# EAGLE schematic EL1034v4 (EAGLE 7.7.0)
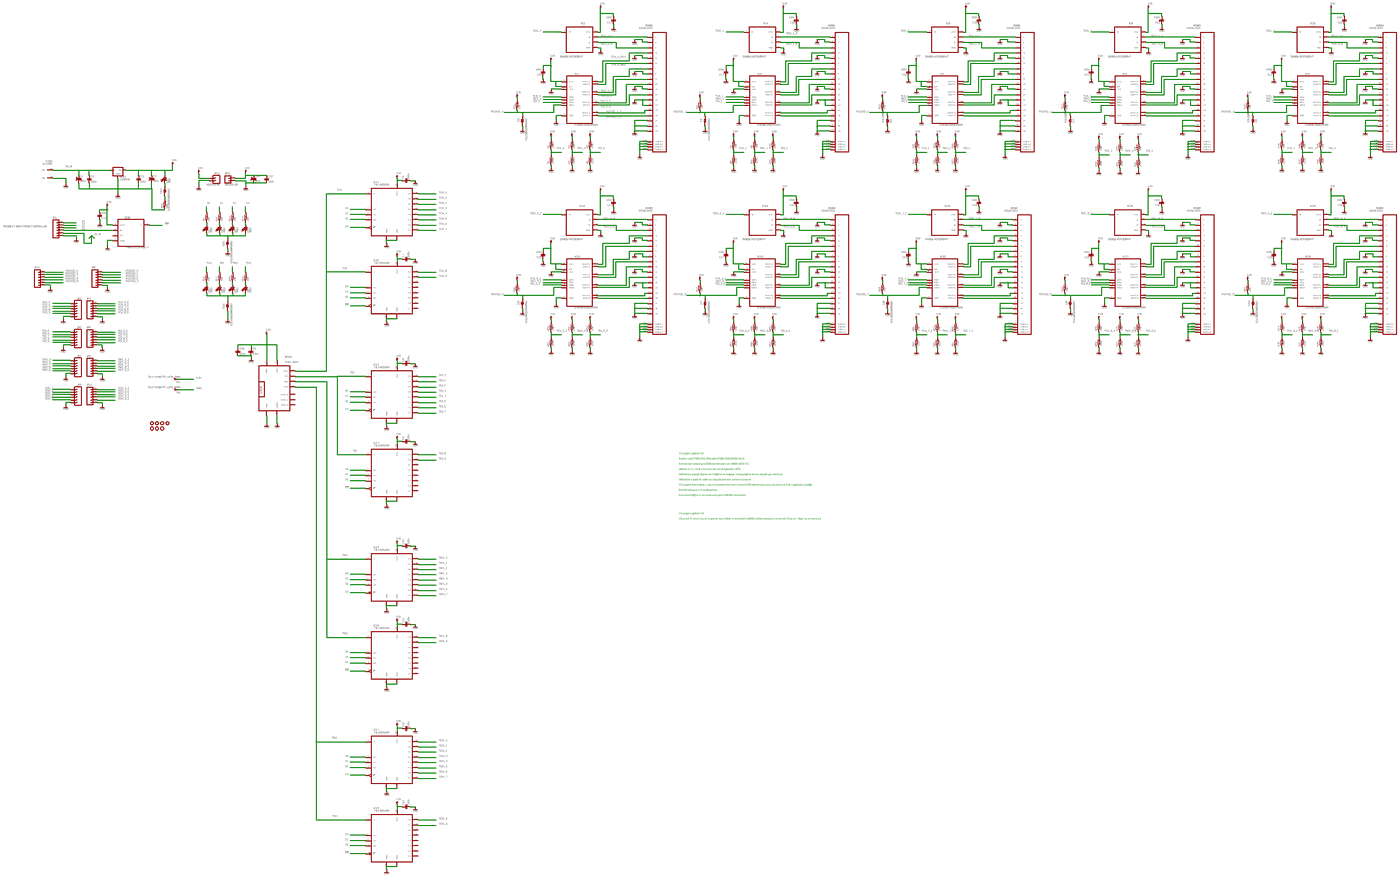
[diagram p0: schematic, sheet 1, overview]
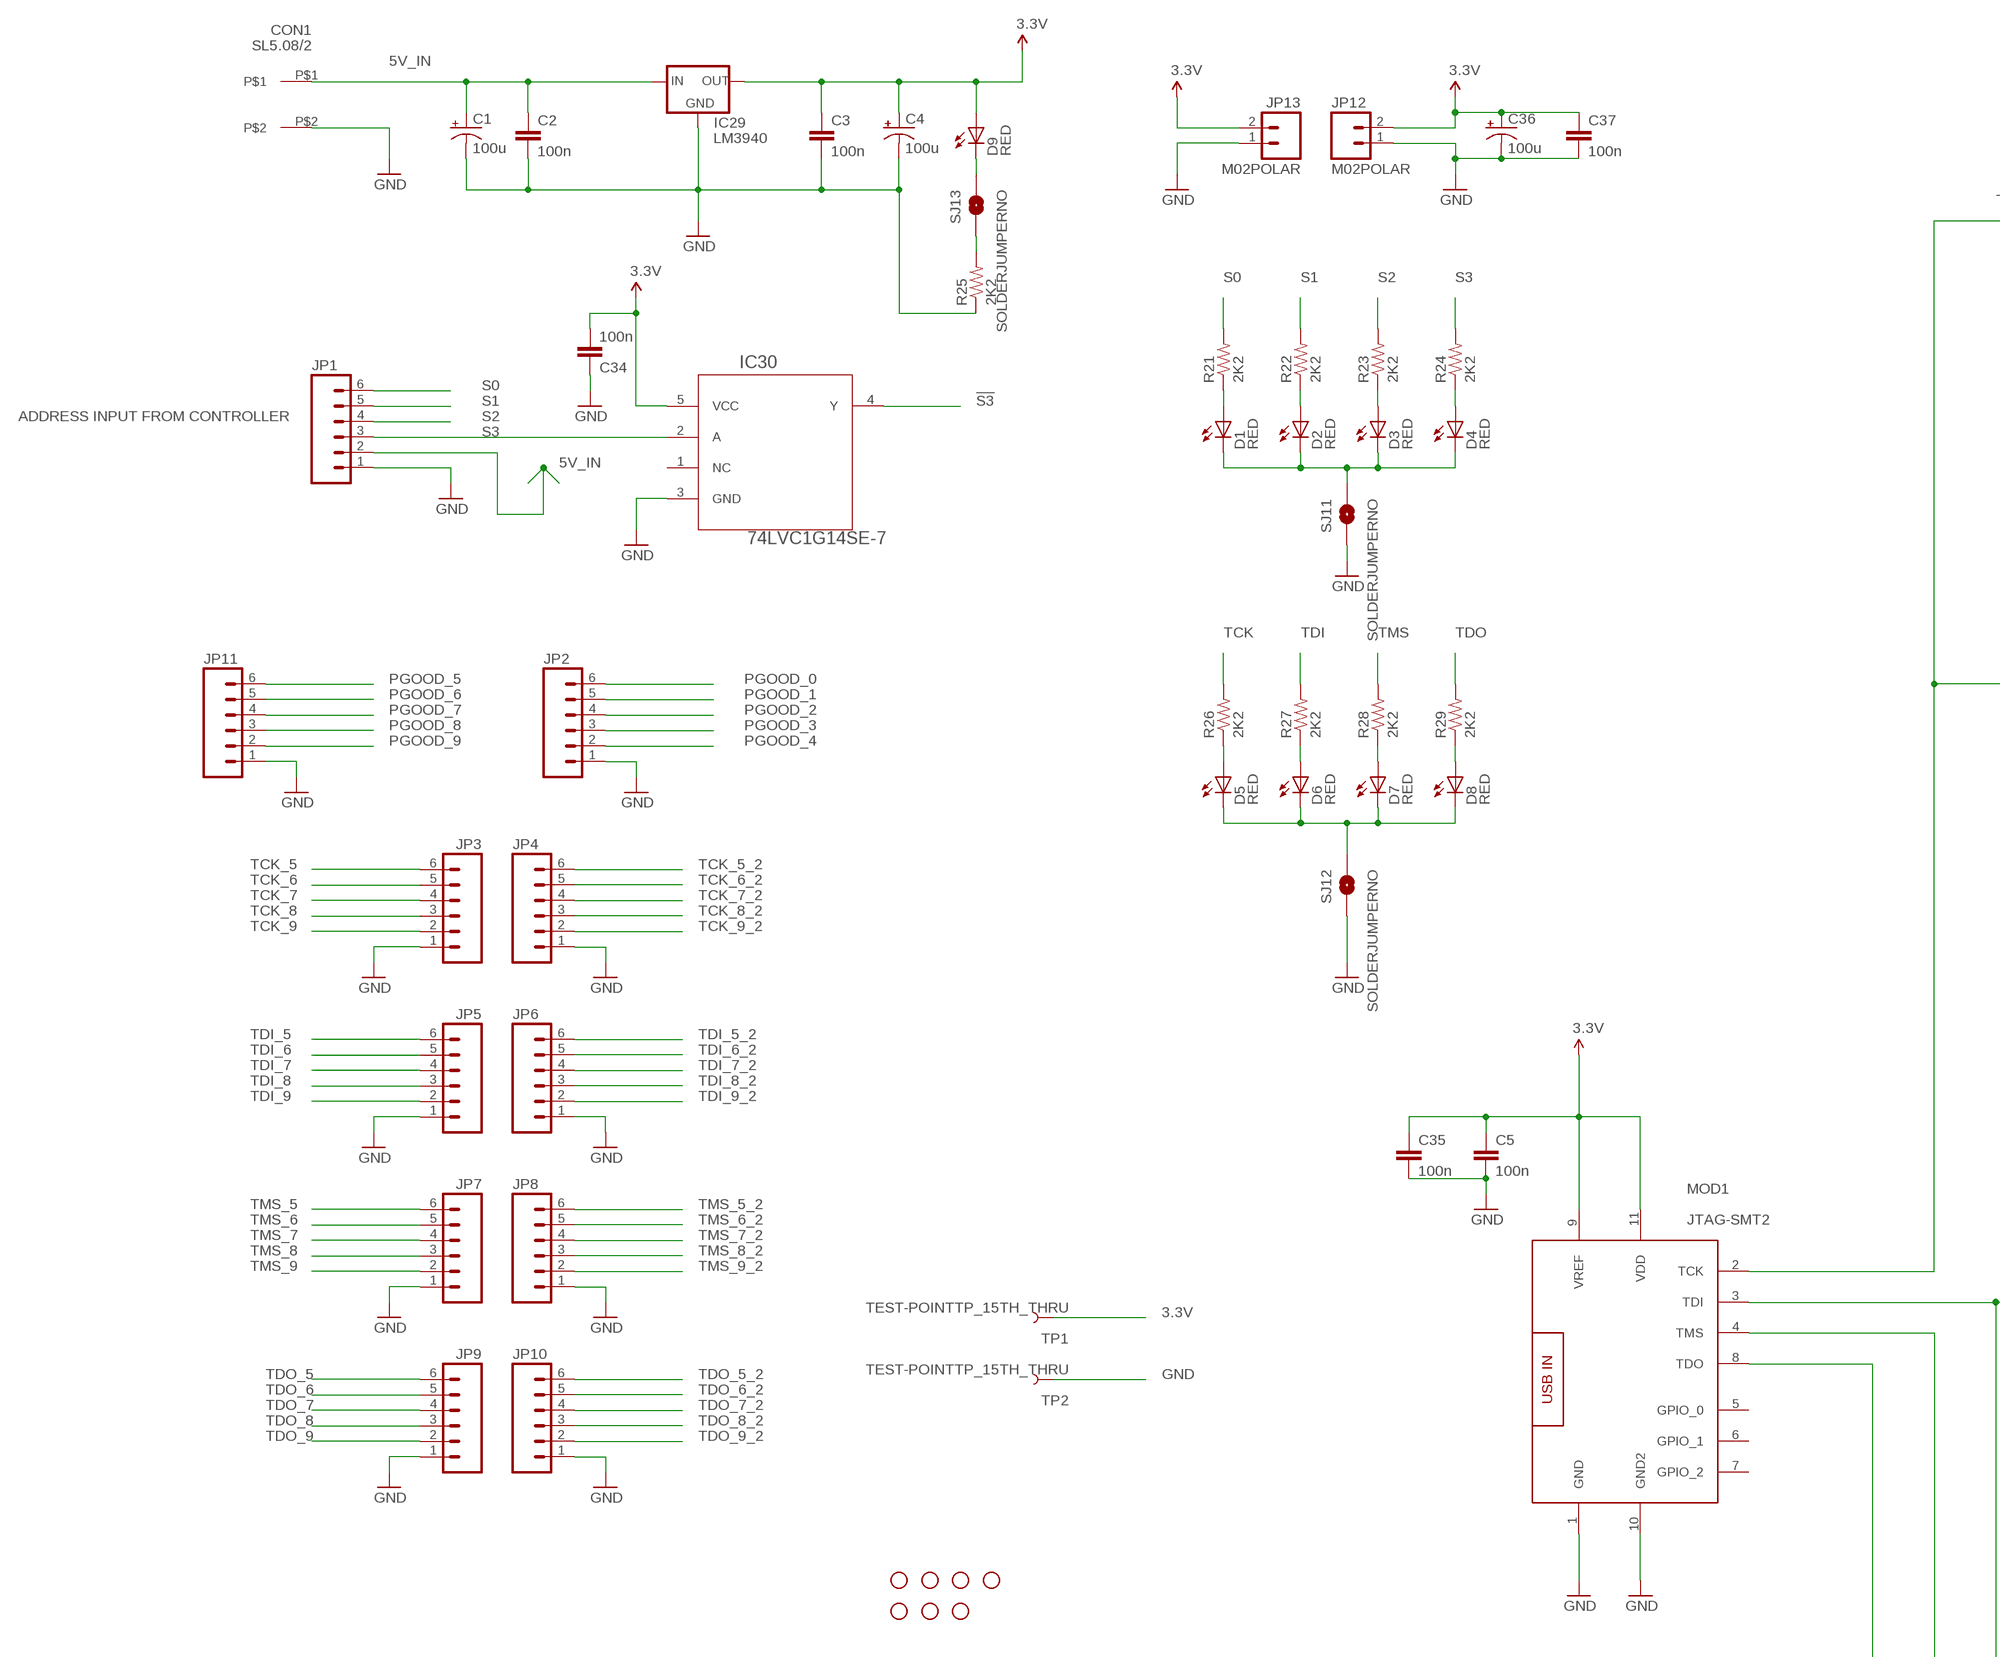
[diagram p1: schematic, sheet 1, part 1 of 6]
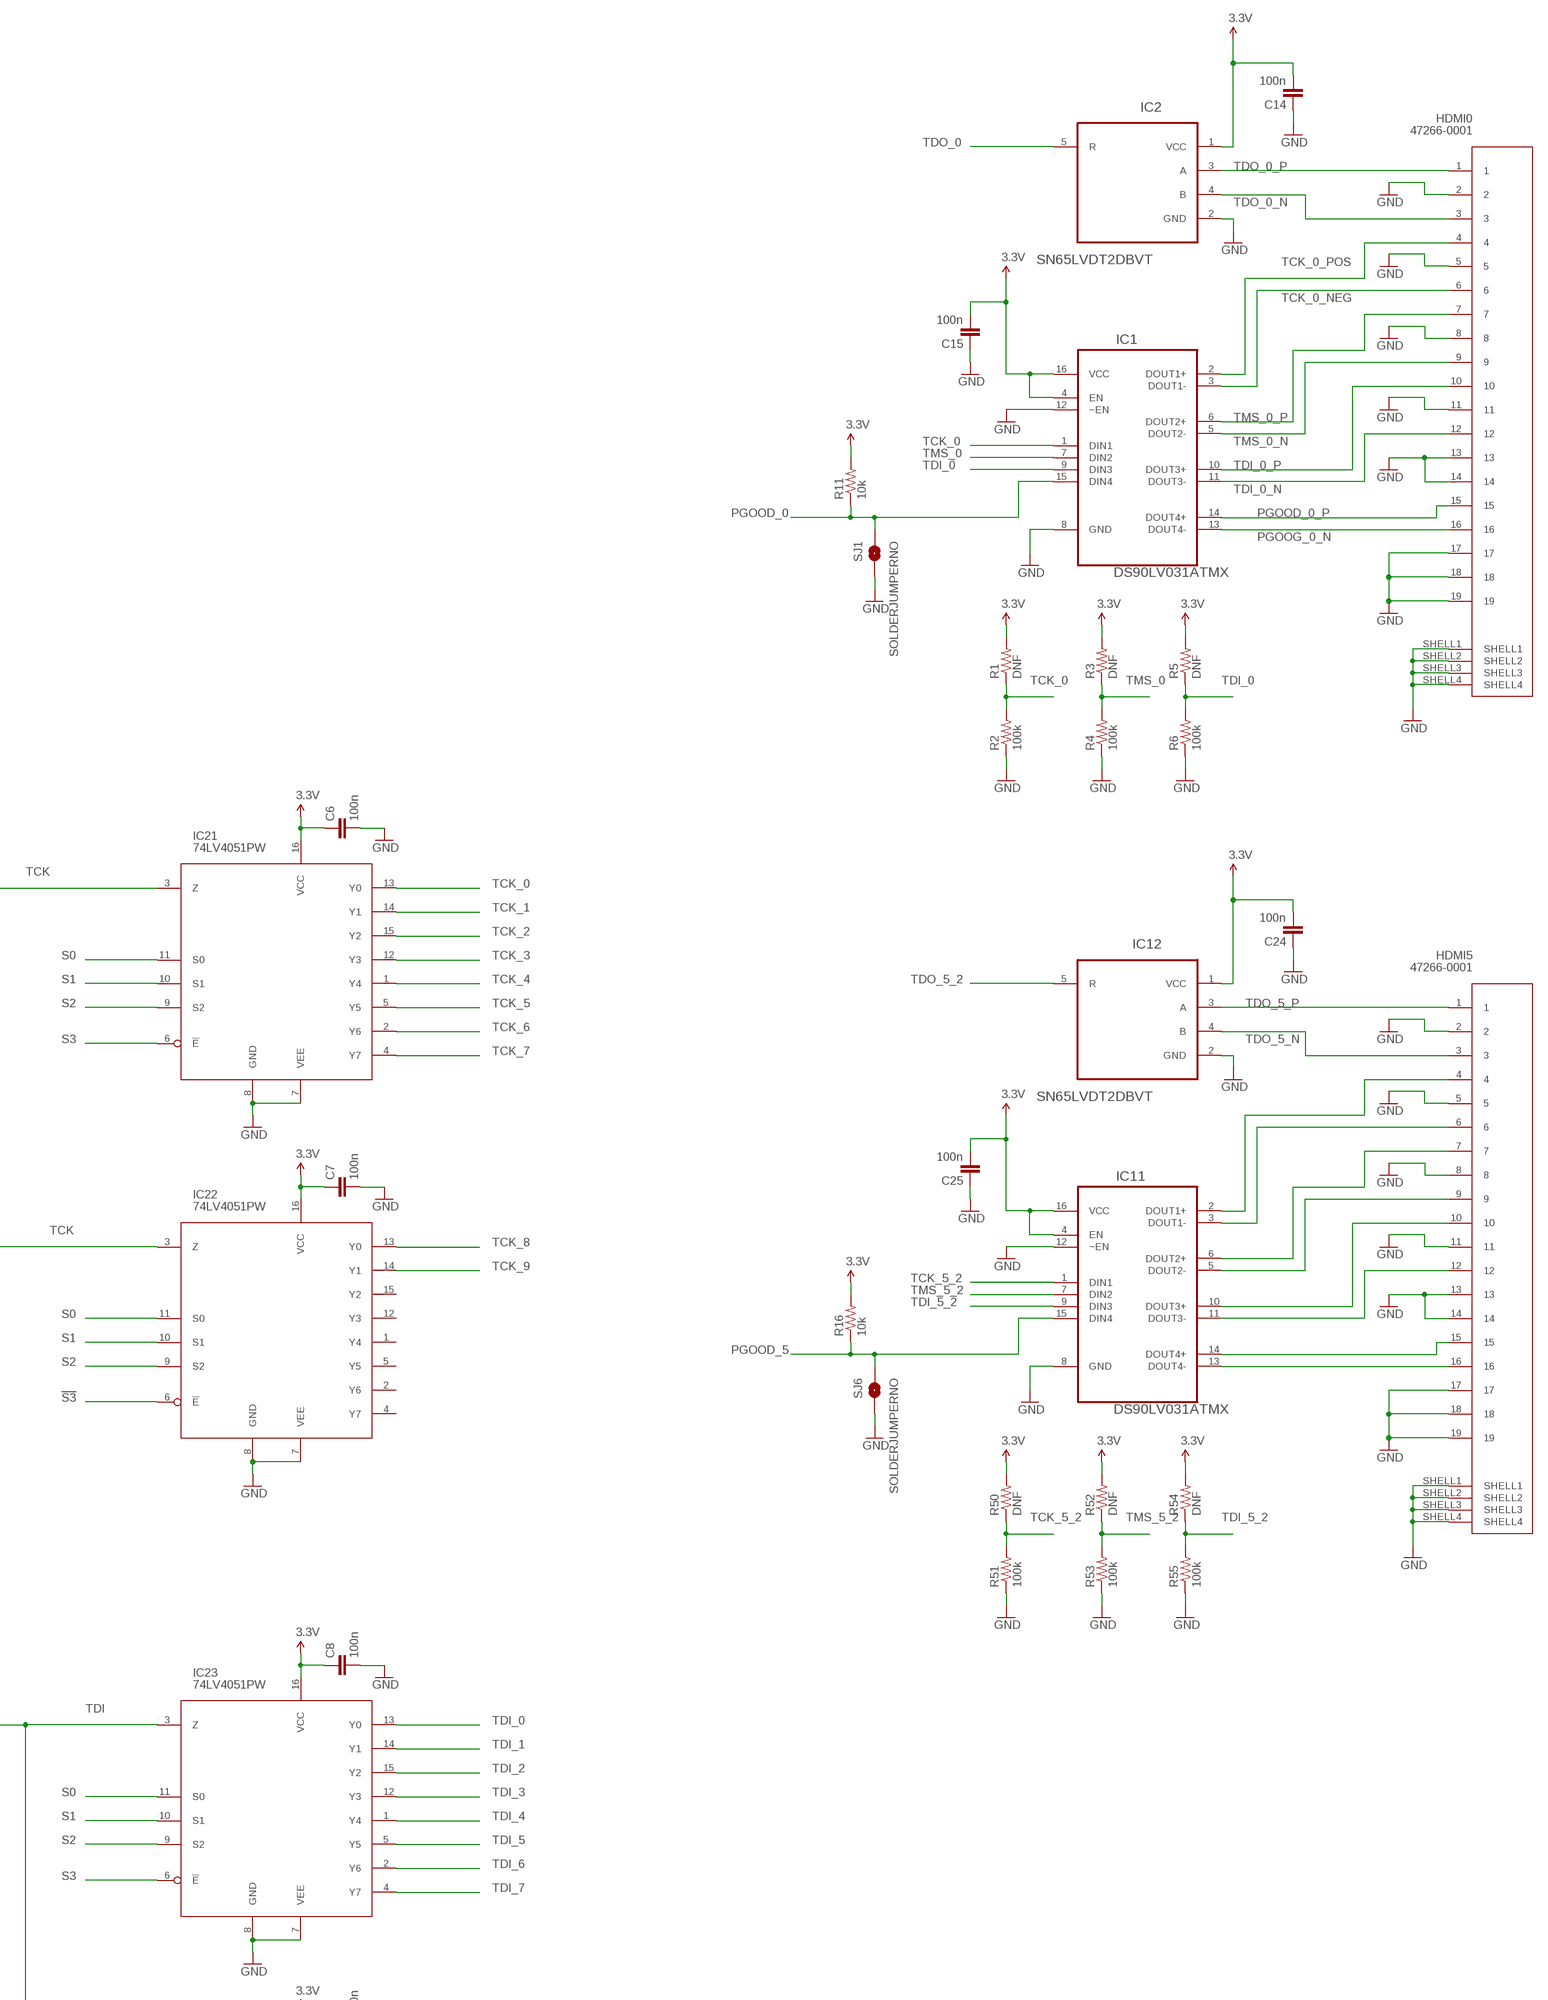
[diagram p2: schematic, sheet 1, part 2 of 6]
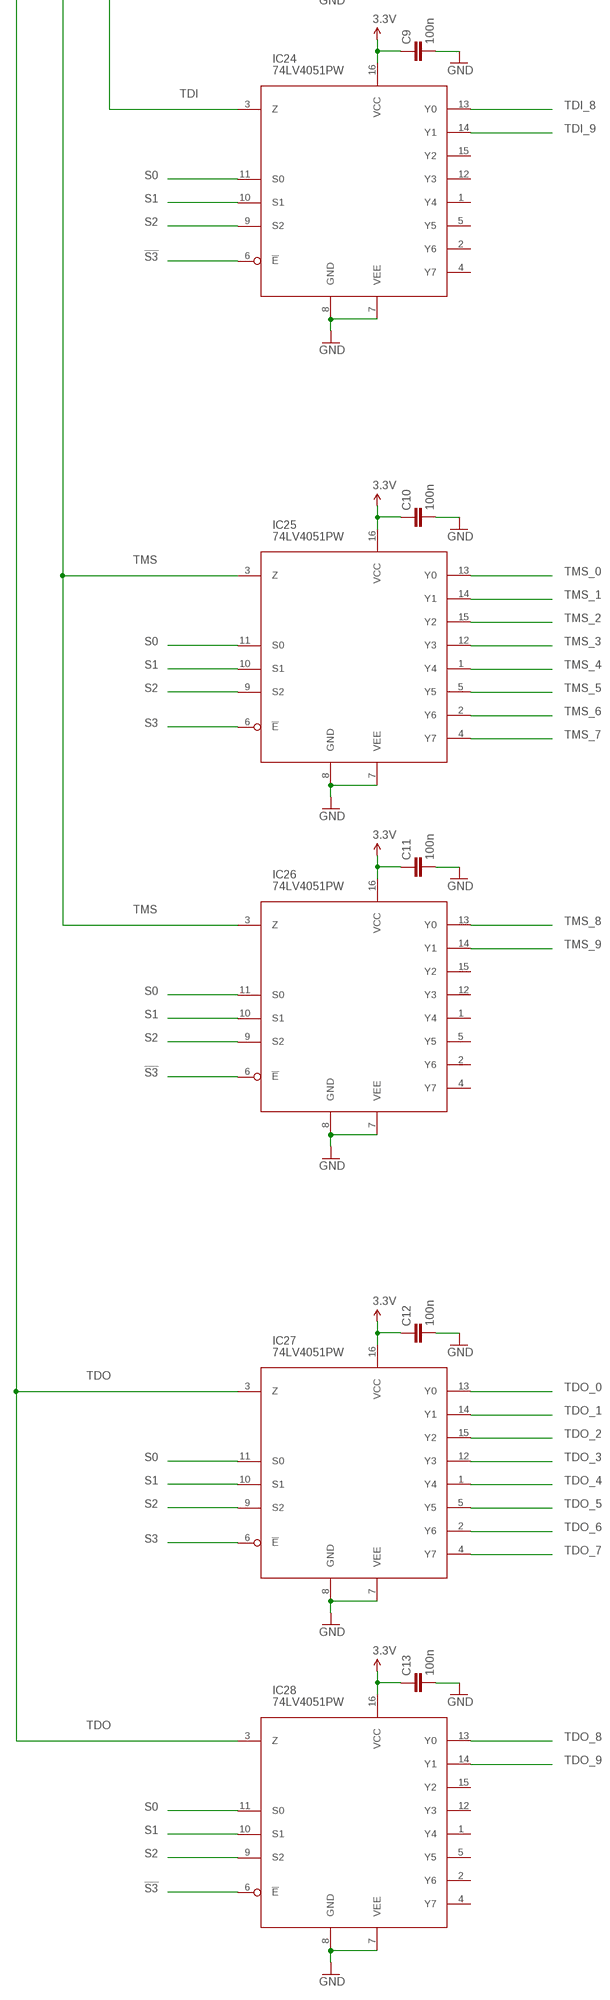
[diagram p3: schematic, sheet 1, part 3 of 6]
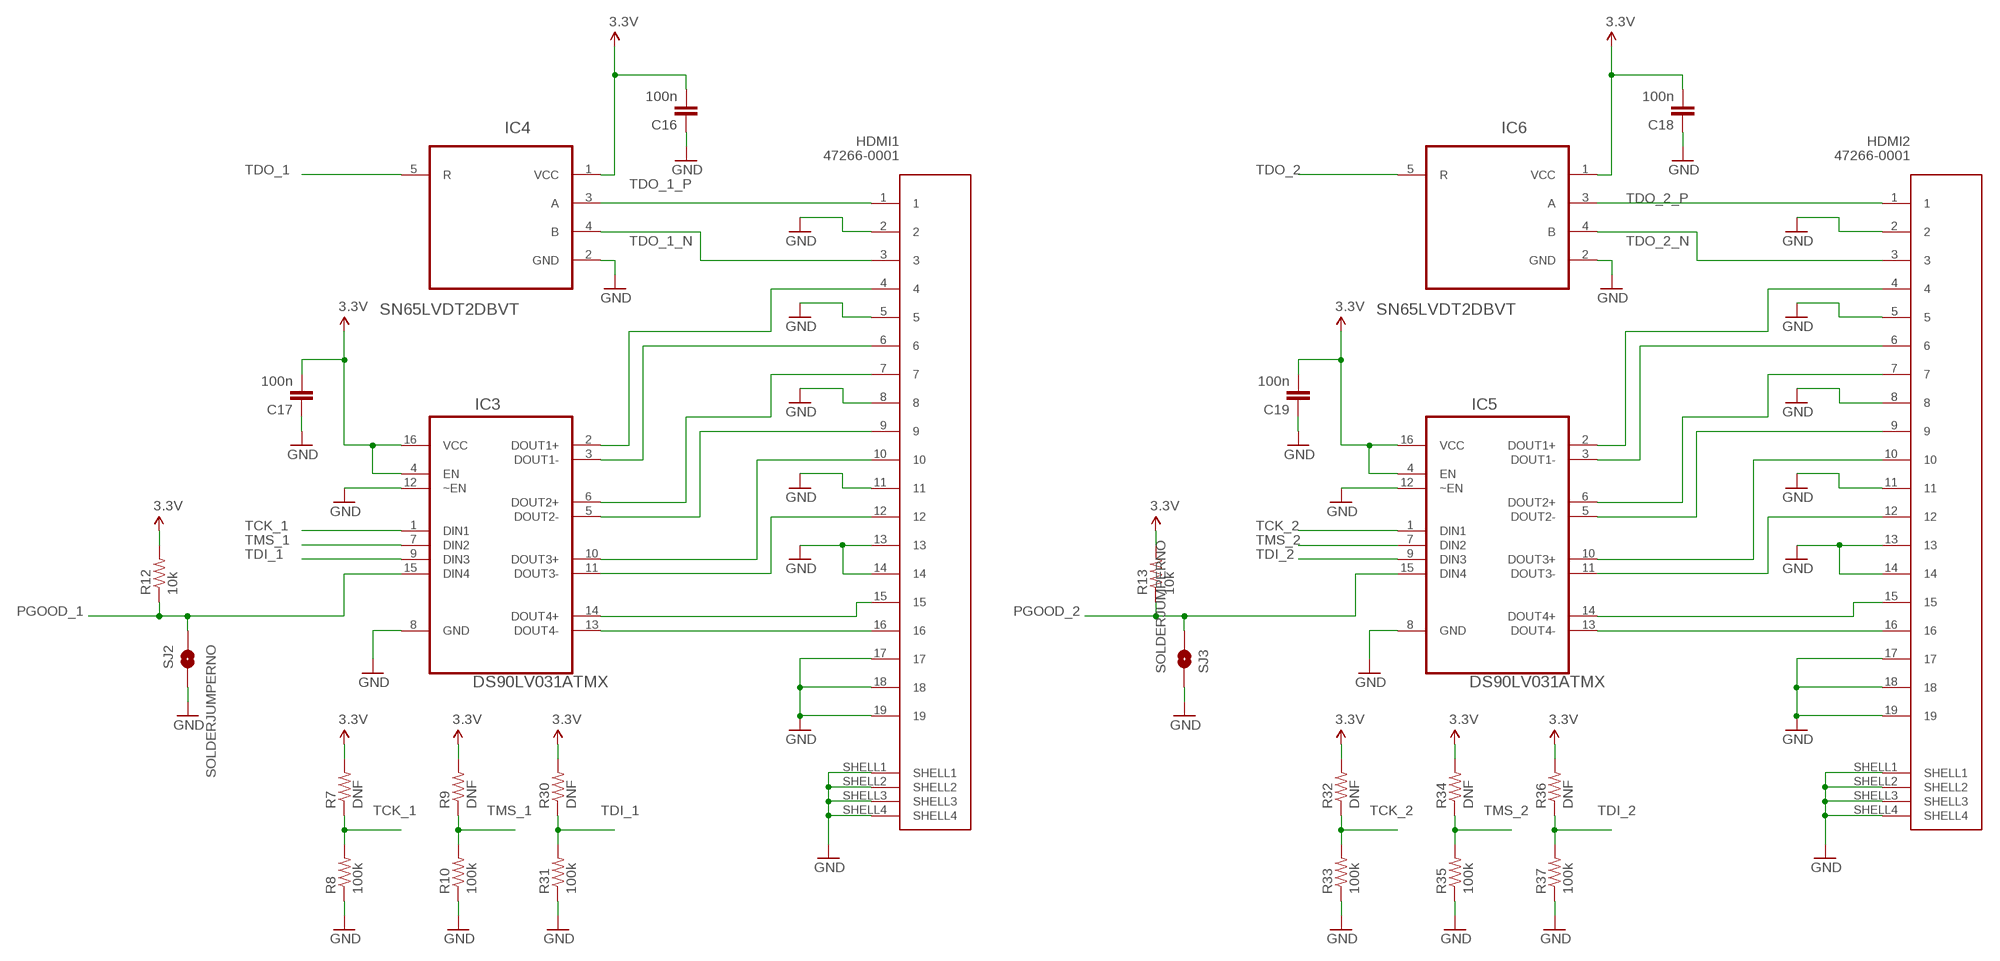
[diagram p4: schematic, sheet 1, part 4 of 6]
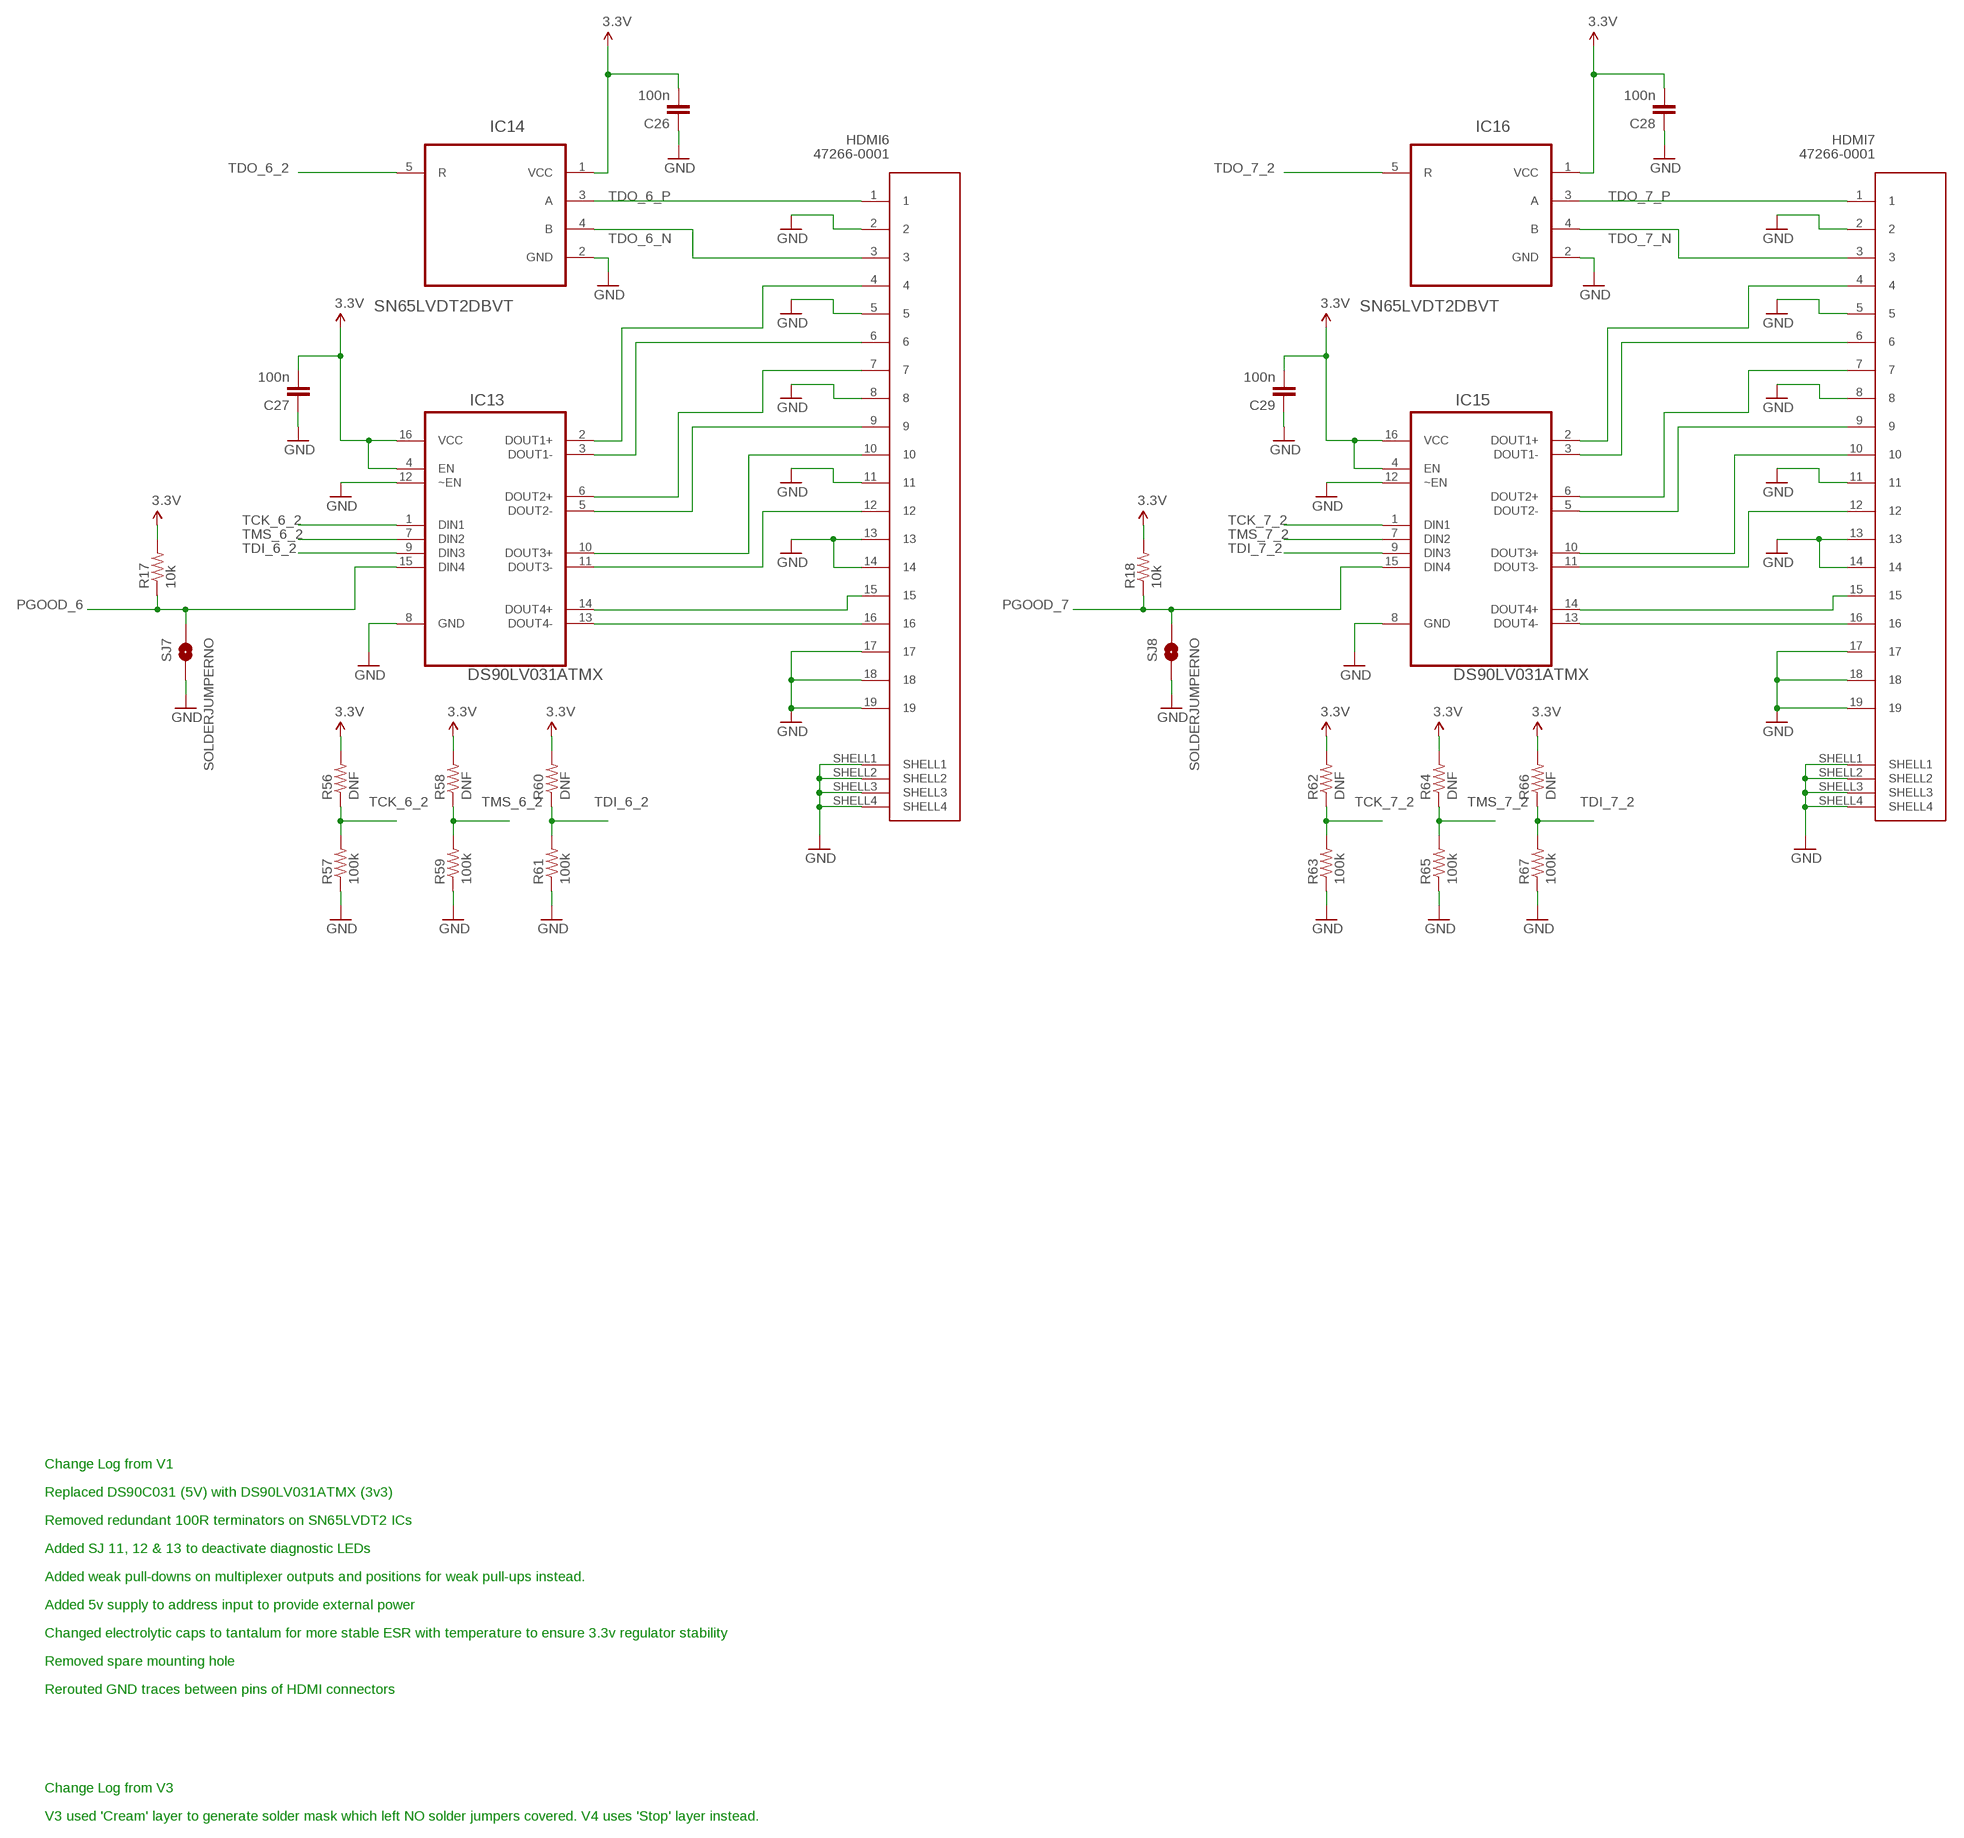
[diagram p5: schematic, sheet 1, part 5 of 6]
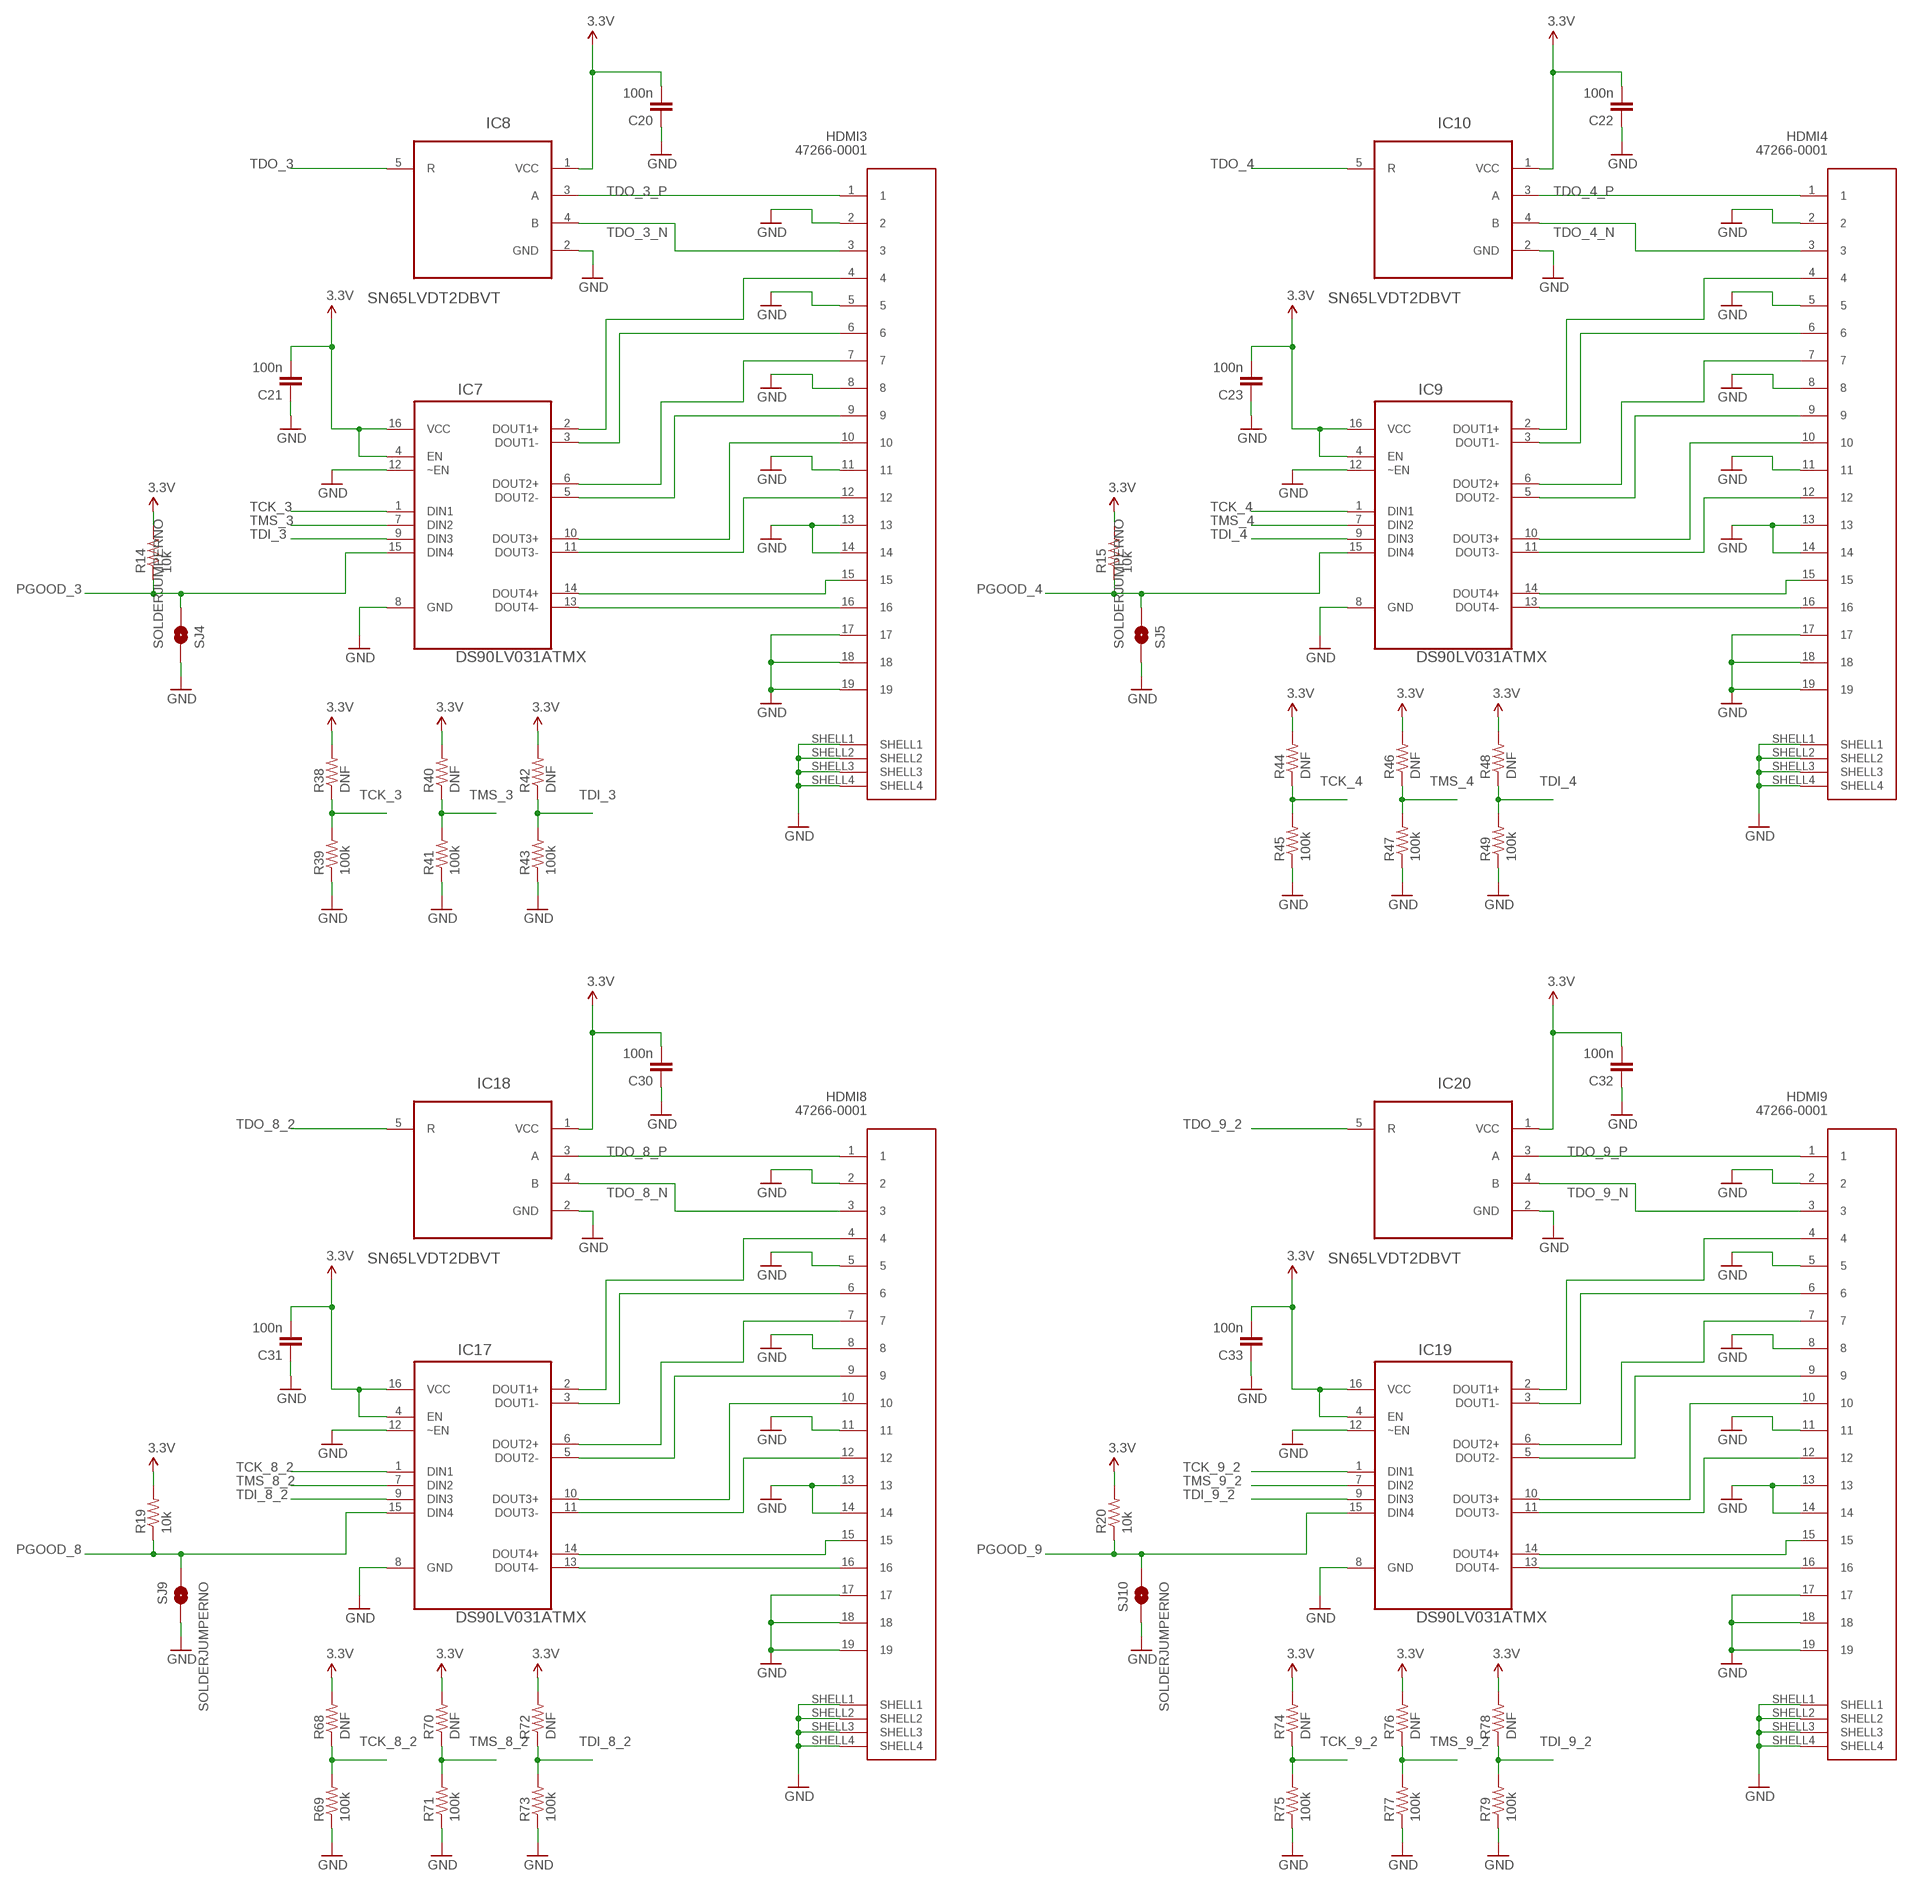
[diagram p6: schematic, sheet 1, part 6 of 6]

## Parts
C1  100u  CAP_POL7343  [EIA7343]
C2  100n  CAP0805  [0805]
C3  100n  CAP0805  [0805]
C4  100u  CAP_POL7343  [EIA7343]
C5  100n  CAP0805  [0805]
C6  100n  CAP0805  [0805]
C7  100n  CAP0805  [0805]
C8  100n  CAP0805  [0805]
C9  100n  CAP0805  [0805]
C10  100n  CAP0805  [0805]
C11  100n  CAP0805  [0805]
C12  100n  CAP0805  [0805]
C13  100n  CAP0805  [0805]
C14  100n  CAP0805  [0805]
C15  100n  CAP0805  [0805]
C16  100n  CAP0805  [0805]
C17  100n  CAP0805  [0805]
C18  100n  CAP0805  [0805]
C19  100n  CAP0805  [0805]
C20  100n  CAP0805  [0805]
C21  100n  CAP0805  [0805]
C22  100n  CAP0805  [0805]
C23  100n  CAP0805  [0805]
C24  100n  CAP0805  [0805]
C25  100n  CAP0805  [0805]
C26  100n  CAP0805  [0805]
C27  100n  CAP0805  [0805]
C28  100n  CAP0805  [0805]
C29  100n  CAP0805  [0805]
C30  100n  CAP0805  [0805]
C31  100n  CAP0805  [0805]
C32  100n  CAP0805  [0805]
C33  100n  CAP0805  [0805]
C34  100n  CAP0805  [0805]
C35  100n  CAP0805  [0805]
C36  100u  CAP_POL7343  [EIA7343]
C37  100n  CAP0805  [0805]
CON1  SL5.08/2  [SL5.08/2]
D1  RED  LED-RED0603  [LED-0603]
D2  RED  LED-RED0603  [LED-0603]
D3  RED  LED-RED0603  [LED-0603]
D4  RED  LED-RED0603  [LED-0603]
D5  RED  LED-RED0603  [LED-0603]
D6  RED  LED-RED0603  [LED-0603]
D7  RED  LED-RED0603  [LED-0603]
D8  RED  LED-RED0603  [LED-0603]
D9  RED  LED-RED0603  [LED-0603]
HDMI0  47266-0001  [47266-0001]
HDMI1  47266-0001  [47266-0001]
HDMI2  47266-0001  [47266-0001]
HDMI3  47266-0001  [47266-0001]
HDMI4  47266-0001  [47266-0001]
HDMI5  47266-0001  [47266-0001]
HDMI6  47266-0001  [47266-0001]
HDMI7  47266-0001  [47266-0001]
HDMI8  47266-0001  [47266-0001]
HDMI9  47266-0001  [47266-0001]
IC1  DS90LV031ATMX  DS90C031TM  [SOIC127P600X175-16N]
IC2  SN65LVDT2DBVT  [SOT95P280X145-5N]
IC3  DS90LV031ATMX  DS90C031TM  [SOIC127P600X175-16N]
IC4  SN65LVDT2DBVT  [SOT95P280X145-5N]
IC5  DS90LV031ATMX  DS90C031TM  [SOIC127P600X175-16N]
IC6  SN65LVDT2DBVT  [SOT95P280X145-5N]
IC7  DS90LV031ATMX  DS90C031TM  [SOIC127P600X175-16N]
IC8  SN65LVDT2DBVT  [SOT95P280X145-5N]
IC9  DS90LV031ATMX  DS90C031TM  [SOIC127P600X175-16N]
IC10  SN65LVDT2DBVT  [SOT95P280X145-5N]
IC11  DS90LV031ATMX  DS90C031TM  [SOIC127P600X175-16N]
IC12  SN65LVDT2DBVT  [SOT95P280X145-5N]
IC13  DS90LV031ATMX  DS90C031TM  [SOIC127P600X175-16N]
IC14  SN65LVDT2DBVT  [SOT95P280X145-5N]
IC15  DS90LV031ATMX  DS90C031TM  [SOIC127P600X175-16N]
IC16  SN65LVDT2DBVT  [SOT95P280X145-5N]
IC17  DS90LV031ATMX  DS90C031TM  [SOIC127P600X175-16N]
IC18  SN65LVDT2DBVT  [SOT95P280X145-5N]
IC19  DS90LV031ATMX  DS90C031TM  [SOIC127P600X175-16N]
IC20  SN65LVDT2DBVT  [SOT95P280X145-5N]
IC21  74LV4051PW  [TSSOP16]
IC22  74LV4051PW  [TSSOP16]
IC23  74LV4051PW  [TSSOP16]
IC24  74LV4051PW  [TSSOP16]
IC25  74LV4051PW  [TSSOP16]
IC26  74LV4051PW  [TSSOP16]
IC27  74LV4051PW  [TSSOP16]
IC28  74LV4051PW  [TSSOP16]
IC29  LM3940  V_REG_78XXSINK  [TO220-IGO]
IC30  74LVC1G14SE-7  [SOT65P210X110-5N]
JP1  M06POLAR  [MOLEX-1X6]
JP2  M06POLAR  [MOLEX-1X6]
JP3  M06POLAR  [MOLEX-1X6]
JP4  M06POLAR  [MOLEX-1X6]
JP5  M06POLAR  [MOLEX-1X6]
JP6  M06POLAR  [MOLEX-1X6]
JP7  M06POLAR  [MOLEX-1X6]
JP8  M06POLAR  [MOLEX-1X6]
JP9  M06POLAR  [MOLEX-1X6]
JP10  M06POLAR  [MOLEX-1X6]
JP11  M06POLAR  [MOLEX-1X6]
JP12  M02POLAR  [MOLEX-1X2]
JP13  M02POLAR  [MOLEX-1X2]
MOD1  JTAG-SMT2  [JTAG_SMT2]
R1  DNF  RESISTOR0603-RES  [0603-RES]
R2  100k  RESISTOR0603-RES  [0603-RES]
R3  DNF  RESISTOR0603-RES  [0603-RES]
R4  100k  RESISTOR0603-RES  [0603-RES]
R5  DNF  RESISTOR0603-RES  [0603-RES]
R6  100k  RESISTOR0603-RES  [0603-RES]
R7  DNF  RESISTOR0603-RES  [0603-RES]
R8  100k  RESISTOR0603-RES  [0603-RES]
R9  DNF  RESISTOR0603-RES  [0603-RES]
R10  100k  RESISTOR0603-RES  [0603-RES]
R11  10k  RESISTOR0603-RES  [0603-RES]
R12  10k  RESISTOR0603-RES  [0603-RES]
R13  10k  RESISTOR0603-RES  [0603-RES]
R14  10k  RESISTOR0603-RES  [0603-RES]
R15  10k  RESISTOR0603-RES  [0603-RES]
R16  10k  RESISTOR0603-RES  [0603-RES]
R17  10k  RESISTOR0603-RES  [0603-RES]
R18  10k  RESISTOR0603-RES  [0603-RES]
R19  10k  RESISTOR0603-RES  [0603-RES]
R20  10k  RESISTOR0603-RES  [0603-RES]
R21  2K2  RESISTOR0603-RES  [0603-RES]
R22  2K2  RESISTOR0603-RES  [0603-RES]
R23  2K2  RESISTOR0603-RES  [0603-RES]
R24  2K2  RESISTOR0603-RES  [0603-RES]
R25  2K2  RESISTOR0603-RES  [0603-RES]
R26  2K2  RESISTOR0603-RES  [0603-RES]
R27  2K2  RESISTOR0603-RES  [0603-RES]
R28  2K2  RESISTOR0603-RES  [0603-RES]
R29  2K2  RESISTOR0603-RES  [0603-RES]
R30  DNF  RESISTOR0603-RES  [0603-RES]
R31  100k  RESISTOR0603-RES  [0603-RES]
R32  DNF  RESISTOR0603-RES  [0603-RES]
R33  100k  RESISTOR0603-RES  [0603-RES]
R34  DNF  RESISTOR0603-RES  [0603-RES]
R35  100k  RESISTOR0603-RES  [0603-RES]
R36  DNF  RESISTOR0603-RES  [0603-RES]
R37  100k  RESISTOR0603-RES  [0603-RES]
R38  DNF  RESISTOR0603-RES  [0603-RES]
R39  100k  RESISTOR0603-RES  [0603-RES]
R40  DNF  RESISTOR0603-RES  [0603-RES]
R41  100k  RESISTOR0603-RES  [0603-RES]
R42  DNF  RESISTOR0603-RES  [0603-RES]
R43  100k  RESISTOR0603-RES  [0603-RES]
R44  DNF  RESISTOR0603-RES  [0603-RES]
R45  100k  RESISTOR0603-RES  [0603-RES]
R46  DNF  RESISTOR0603-RES  [0603-RES]
R47  100k  RESISTOR0603-RES  [0603-RES]
R48  DNF  RESISTOR0603-RES  [0603-RES]
R49  100k  RESISTOR0603-RES  [0603-RES]
R50  DNF  RESISTOR0603-RES  [0603-RES]
R51  100k  RESISTOR0603-RES  [0603-RES]
R52  DNF  RESISTOR0603-RES  [0603-RES]
R53  100k  RESISTOR0603-RES  [0603-RES]
R54  DNF  RESISTOR0603-RES  [0603-RES]
R55  100k  RESISTOR0603-RES  [0603-RES]
R56  DNF  RESISTOR0603-RES  [0603-RES]
R57  100k  RESISTOR0603-RES  [0603-RES]
R58  DNF  RESISTOR0603-RES  [0603-RES]
R59  100k  RESISTOR0603-RES  [0603-RES]
R60  DNF  RESISTOR0603-RES  [0603-RES]
R61  100k  RESISTOR0603-RES  [0603-RES]
R62  DNF  RESISTOR0603-RES  [0603-RES]
R63  100k  RESISTOR0603-RES  [0603-RES]
R64  DNF  RESISTOR0603-RES  [0603-RES]
R65  100k  RESISTOR0603-RES  [0603-RES]
R66  DNF  RESISTOR0603-RES  [0603-RES]
R67  100k  RESISTOR0603-RES  [0603-RES]
R68  DNF  RESISTOR0603-RES  [0603-RES]
R69  100k  RESISTOR0603-RES  [0603-RES]
R70  DNF  RESISTOR0603-RES  [0603-RES]
R71  100k  RESISTOR0603-RES  [0603-RES]
R72  DNF  RESISTOR0603-RES  [0603-RES]
R73  100k  RESISTOR0603-RES  [0603-RES]
R74  DNF  RESISTOR0603-RES  [0603-RES]
R75  100k  RESISTOR0603-RES  [0603-RES]
R76  DNF  RESISTOR0603-RES  [0603-RES]
R77  100k  RESISTOR0603-RES  [0603-RES]
R78  DNF  RESISTOR0603-RES  [0603-RES]
R79  100k  RESISTOR0603-RES  [0603-RES]
SJ1  SOLDERJUMPERNO  [SJ_2S-NO]
SJ2  SOLDERJUMPERNO  [SJ_2S-NO]
SJ3  SOLDERJUMPERNO  [SJ_2S-NO]
SJ4  SOLDERJUMPERNO  [SJ_2S-NO]
SJ5  SOLDERJUMPERNO  [SJ_2S-NO]
SJ6  SOLDERJUMPERNO  [SJ_2S-NO]
SJ7  SOLDERJUMPERNO  [SJ_2S-NO]
SJ8  SOLDERJUMPERNO  [SJ_2S-NO]
SJ9  SOLDERJUMPERNO  [SJ_2S-NO]
SJ10  SOLDERJUMPERNO  [SJ_2S-NO]
SJ11  SOLDERJUMPERNO  [SJ_2S-NO]
SJ12  SOLDERJUMPERNO  [SJ_2S-NO]
SJ13  SOLDERJUMPERNO  [SJ_2S-NO]
STANDOFF1  STAND-OFF  [STAND-OFF]
STANDOFF2  STAND-OFF  [STAND-OFF]
STANDOFF3  STAND-OFF  [STAND-OFF]
STANDOFF4  STAND-OFF  [STAND-OFF]
STANDOFF5  STAND-OFF  [STAND-OFF]
STANDOFF6  STAND-OFF  [STAND-OFF]
STANDOFF7  STAND-OFF  [STAND-OFF]
TP1  TEST-POINTTP_15TH_THRU  [TP_15TH]
TP2  TEST-POINTTP_15TH_THRU  [TP_15TH]

## Nets
3.3V: C3.1 C4.A(+) C5.1 C6.1 C7.1 C8.1 C9.1 C10.1 C11.1 C12.1 C13.1 C14.2 C15.2 C16.2 C17.2 C18.2 C19.2 C20.2 C21.2 C22.2 C23.2 C24.2 C25.2 C26.2 C27.2 C28.2 C29.2 C30.2 C31.2 C32.2 C33.2 C34.2 C35.1 C36.A(+) C37.1 D9.A IC1.4(EN) IC1.16(VCC) IC2.1(VCC) IC3.4(EN) IC3.16(VCC) IC4.1(VCC) IC5.4(EN) IC5.16(VCC) IC6.1(VCC) IC7.4(EN) IC7.16(VCC) IC8.1(VCC) IC9.4(EN) IC9.16(VCC) IC10.1(VCC) IC11.4(EN) IC11.16(VCC) IC12.1(VCC) IC13.4(EN) IC13.16(VCC) IC14.1(VCC) IC15.4(EN) IC15.16(VCC) IC16.1(VCC) IC17.4(EN) IC17.16(VCC) IC18.1(VCC) IC19.4(EN) IC19.16(VCC) IC20.1(VCC) IC21.16(VCC) IC22.16(VCC) IC23.16(VCC) IC24.16(VCC) IC25.16(VCC) IC26.16(VCC) IC27.16(VCC) IC28.16(VCC) IC29.OUT IC30.5(VCC) JP12.2 JP13.2 MOD1.9(VREF) MOD1.11(VDD) R1.2 R3.2 R5.2 R7.2 R9.2 R11.2 R12.2 R13.2 R14.2 R15.2 R16.2 R17.2 R18.2 R19.2 R20.2 R30.2 R32.2 R34.2 R36.2 R38.2 R40.2 R42.2 R44.2 R46.2 R48.2 R50.2 R52.2 R54.2 R56.2 R58.2 R60.2 R62.2 R64.2 R66.2 R68.2 R70.2 R72.2 R74.2 R76.2 R78.2 TP1.P$1
5V_IN: C1.A(+) C2.1 CON1.P$1 IC29.IN JP1.2
!S3: IC22.6(!E) IC24.6(!E) IC26.6(!E) IC28.6(!E) IC30.4(Y)
GND: C1.C(-) C2.2 C3.2 C4.C(-) C5.2 C6.2 C7.2 C8.2 C9.2 C10.2 C11.2 C12.2 C13.2 C14.1 C15.1 C16.1 C17.1 C18.1 C19.1 C20.1 C21.1 C22.1 C23.1 C24.1 C25.1 C26.1 C27.1 C28.1 C29.1 C30.1 C31.1 C32.1 C33.1 C34.1 C35.2 C36.C(-) C37.2 CON1.P$2 HDMI0.2 HDMI0.5 HDMI0.8 HDMI0.11 HDMI0.13 HDMI0.14 HDMI0.17 HDMI0.18 HDMI0.19 HDMI0.SHELL1 HDMI0.SHELL2 HDMI0.SHELL3 HDMI0.SHELL4 HDMI1.2 HDMI1.5 HDMI1.8 HDMI1.11 HDMI1.13 HDMI1.14 HDMI1.17 HDMI1.18 HDMI1.19 HDMI1.SHELL1 HDMI1.SHELL2 HDMI1.SHELL3 HDMI1.SHELL4 HDMI2.2 HDMI2.5 HDMI2.8 HDMI2.11 HDMI2.13 HDMI2.14 HDMI2.17 HDMI2.18 HDMI2.19 HDMI2.SHELL1 HDMI2.SHELL2 HDMI2.SHELL3 HDMI2.SHELL4 HDMI3.2 HDMI3.5 HDMI3.8 HDMI3.11 HDMI3.13 HDMI3.14 HDMI3.17 HDMI3.18 HDMI3.19 HDMI3.SHELL1 HDMI3.SHELL2 HDMI3.SHELL3 HDMI3.SHELL4 HDMI4.2 HDMI4.5 HDMI4.8 HDMI4.11 HDMI4.13 HDMI4.14 HDMI4.17 HDMI4.18 HDMI4.19 HDMI4.SHELL1 HDMI4.SHELL2 HDMI4.SHELL3 HDMI4.SHELL4 HDMI5.2 HDMI5.5 HDMI5.8 HDMI5.11 HDMI5.13 HDMI5.14 HDMI5.17 HDMI5.18 HDMI5.19 HDMI5.SHELL1 HDMI5.SHELL2 HDMI5.SHELL3 HDMI5.SHELL4 HDMI6.2 HDMI6.5 HDMI6.8 HDMI6.11 HDMI6.13 HDMI6.14 HDMI6.17 HDMI6.18 HDMI6.19 HDMI6.SHELL1 HDMI6.SHELL2 HDMI6.SHELL3 HDMI6.SHELL4 HDMI7.2 HDMI7.5 HDMI7.8 HDMI7.11 HDMI7.13 HDMI7.14 HDMI7.17 HDMI7.18 HDMI7.19 HDMI7.SHELL1 HDMI7.SHELL2 HDMI7.SHELL3 HDMI7.SHELL4 HDMI8.2 HDMI8.5 HDMI8.8 HDMI8.11 HDMI8.13 HDMI8.14 HDMI8.17 HDMI8.18 HDMI8.19 HDMI8.SHELL1 HDMI8.SHELL2 HDMI8.SHELL3 HDMI8.SHELL4 HDMI9.2 HDMI9.5 HDMI9.8 HDMI9.11 HDMI9.13 HDMI9.14 HDMI9.17 HDMI9.18 HDMI9.19 HDMI9.SHELL1 HDMI9.SHELL2 HDMI9.SHELL3 HDMI9.SHELL4 IC1.8(GND) IC1.12(~EN) IC2.2(GND) IC3.8(GND) IC3.12(~EN) IC4.2(GND) IC5.8(GND) IC5.12(~EN) IC6.2(GND) IC7.8(GND) IC7.12(~EN) IC8.2(GND) IC9.8(GND) IC9.12(~EN) IC10.2(GND) IC11.8(GND) IC11.12(~EN) IC12.2(GND) IC13.8(GND) IC13.12(~EN) IC14.2(GND) IC15.8(GND) IC15.12(~EN) IC16.2(GND) IC17.8(GND) IC17.12(~EN) IC18.2(GND) IC19.8(GND) IC19.12(~EN) IC20.2(GND) IC21.7(VEE) IC21.8(GND) IC22.7(VEE) IC22.8(GND) IC23.7(VEE) IC23.8(GND) IC24.7(VEE) IC24.8(GND) IC25.7(VEE) IC25.8(GND) IC26.7(VEE) IC26.8(GND) IC27.7(VEE) IC27.8(GND) IC28.7(VEE) IC28.8(GND) IC29.GND IC30.3(GND) JP1.1 JP2.1 JP3.1 JP4.1 JP5.1 JP6.1 JP7.1 JP8.1 JP9.1 JP10.1 JP11.1 JP12.1 JP13.1 MOD1.1(GND) MOD1.10(GND2) R2.1 R4.1 R6.1 R8.1 R10.1 R25.1 R31.1 R33.1 R35.1 R37.1 R39.1 R41.1 R43.1 R45.1 R47.1 R49.1 R51.1 R53.1 R55.1 R57.1 R59.1 R61.1 R63.1 R65.1 R67.1 R69.1 R71.1 R73.1 R75.1 R77.1 R79.1 SJ1.2 SJ2.2 SJ3.1 SJ4.1 SJ5.1 SJ6.2 SJ7.2 SJ8.2 SJ9.2 SJ10.2 SJ11.2 SJ12.2 TP2.P$1
N$1: D1.A R21.1
N$3: D2.A R22.1
N$4: D3.A R23.1
N$5: D4.A R24.1
N$6: D9.C SJ13.1
N$7: D5.A R26.1
N$8: D6.A R27.1
N$9: D7.A R28.1
N$10: D8.A R29.1
N$11: R25.2 SJ13.2
N$12: D1.C D2.C D3.C D4.C SJ11.1
N$13: D5.C D6.C D7.C D8.C SJ12.1
N$15: HDMI1.10 IC3.10(DOUT3+)
N$16: HDMI1.12 IC3.11(DOUT3-)
N$17: HDMI1.7 IC3.6(DOUT2+)
N$18: HDMI1.9 IC3.5(DOUT2-)
N$19: HDMI1.15 IC3.14(DOUT4+)
N$20: HDMI1.16 IC3.13(DOUT4-)
N$21: HDMI1.6 IC3.3(DOUT1-)
N$22: HDMI1.4 IC3.2(DOUT1+)
N$28: HDMI2.10 IC5.10(DOUT3+)
N$29: HDMI2.12 IC5.11(DOUT3-)
N$30: HDMI2.7 IC5.6(DOUT2+)
N$31: HDMI2.9 IC5.5(DOUT2-)
N$32: HDMI2.15 IC5.14(DOUT4+)
N$33: HDMI2.16 IC5.13(DOUT4-)
N$34: HDMI2.6 IC5.3(DOUT1-)
N$35: HDMI2.4 IC5.2(DOUT1+)
N$41: HDMI3.10 IC7.10(DOUT3+)
N$42: HDMI3.12 IC7.11(DOUT3-)
N$43: HDMI3.7 IC7.6(DOUT2+)
N$44: HDMI3.9 IC7.5(DOUT2-)
N$45: HDMI3.15 IC7.14(DOUT4+)
N$46: HDMI3.16 IC7.13(DOUT4-)
N$47: HDMI3.6 IC7.3(DOUT1-)
N$48: HDMI3.4 IC7.2(DOUT1+)
N$54: HDMI4.10 IC9.10(DOUT3+)
N$55: HDMI4.12 IC9.11(DOUT3-)
N$56: HDMI4.7 IC9.6(DOUT2+)
N$57: HDMI4.9 IC9.5(DOUT2-)
N$58: HDMI4.15 IC9.14(DOUT4+)
N$59: HDMI4.16 IC9.13(DOUT4-)
N$60: HDMI4.6 IC9.3(DOUT1-)
N$61: HDMI4.4 IC9.2(DOUT1+)
N$67: HDMI5.10 IC11.10(DOUT3+)
N$68: HDMI5.12 IC11.11(DOUT3-)
N$69: HDMI5.7 IC11.6(DOUT2+)
N$70: HDMI5.9 IC11.5(DOUT2-)
N$71: HDMI5.15 IC11.14(DOUT4+)
N$72: HDMI5.16 IC11.13(DOUT4-)
N$73: HDMI5.6 IC11.3(DOUT1-)
N$74: HDMI5.4 IC11.2(DOUT1+)
N$80: HDMI6.10 IC13.10(DOUT3+)
N$81: HDMI6.12 IC13.11(DOUT3-)
N$82: HDMI6.7 IC13.6(DOUT2+)
N$83: HDMI6.9 IC13.5(DOUT2-)
N$84: HDMI6.15 IC13.14(DOUT4+)
N$85: HDMI6.16 IC13.13(DOUT4-)
N$86: HDMI6.6 IC13.3(DOUT1-)
N$87: HDMI6.4 IC13.2(DOUT1+)
N$93: HDMI7.10 IC15.10(DOUT3+)
N$94: HDMI7.12 IC15.11(DOUT3-)
N$95: HDMI7.7 IC15.6(DOUT2+)
N$96: HDMI7.9 IC15.5(DOUT2-)
N$97: HDMI7.15 IC15.14(DOUT4+)
N$98: HDMI7.16 IC15.13(DOUT4-)
N$99: HDMI7.6 IC15.3(DOUT1-)
N$100: HDMI7.4 IC15.2(DOUT1+)
N$106: HDMI8.10 IC17.10(DOUT3+)
N$107: HDMI8.12 IC17.11(DOUT3-)
N$108: HDMI8.7 IC17.6(DOUT2+)
N$109: HDMI8.9 IC17.5(DOUT2-)
N$110: HDMI8.15 IC17.14(DOUT4+)
N$111: HDMI8.16 IC17.13(DOUT4-)
N$112: HDMI8.6 IC17.3(DOUT1-)
N$113: HDMI8.4 IC17.2(DOUT1+)
N$119: HDMI9.10 IC19.10(DOUT3+)
N$120: HDMI9.12 IC19.11(DOUT3-)
N$121: HDMI9.7 IC19.6(DOUT2+)
N$122: HDMI9.9 IC19.5(DOUT2-)
N$123: HDMI9.15 IC19.14(DOUT4+)
N$124: HDMI9.16 IC19.13(DOUT4-)
N$125: HDMI9.6 IC19.3(DOUT1-)
N$126: HDMI9.4 IC19.2(DOUT1+)
PGOOD_0: IC1.15(DIN4) JP2.6 R11.1 SJ1.1
PGOOD_0_P: HDMI0.15 IC1.14(DOUT4+)
PGOOD_1: IC3.15(DIN4) JP2.5 R12.1 SJ2.1
PGOOD_2: IC5.15(DIN4) JP2.4 R13.1 SJ3.2
PGOOD_3: IC7.15(DIN4) JP2.3 R14.1 SJ4.2
PGOOD_4: IC9.15(DIN4) JP2.2 R15.1 SJ5.2
PGOOD_5: IC11.15(DIN4) JP11.6 R16.1 SJ6.1
PGOOD_6: IC13.15(DIN4) JP11.5 R17.1 SJ7.1
PGOOD_7: IC15.15(DIN4) JP11.4 R18.1 SJ8.1
PGOOD_8: IC17.15(DIN4) JP11.3 R19.1 SJ9.1
PGOOD_9: IC19.15(DIN4) JP11.2 R20.1 SJ10.1
PGOOG_0_N: HDMI0.16 IC1.13(DOUT4-)
S0: IC21.11(S0) IC22.11(S0) IC23.11(S0) IC24.11(S0) IC25.11(S0) IC26.11(S0) IC27.11(S0) IC28.11(S0) JP1.6 R21.2
S1: IC21.10(S1) IC22.10(S1) IC23.10(S1) IC24.10(S1) IC25.10(S1) IC26.10(S1) IC27.10(S1) IC28.10(S1) JP1.5 R22.2
S2: IC21.9(S2) IC22.9(S2) IC23.9(S2) IC24.9(S2) IC25.9(S2) IC26.9(S2) IC27.9(S2) IC28.9(S2) JP1.4 R23.2
S3: IC21.6(!E) IC23.6(!E) IC25.6(!E) IC27.6(!E) IC30.2(A) JP1.3 R24.2
TCK: IC21.3(Z) IC22.3(Z) MOD1.2(TCK) R26.2
TCK_0: IC1.1(DIN1) IC21.13(Y0) R1.1 R2.2
TCK_0_NEG: HDMI0.6 IC1.3(DOUT1-)
TCK_0_POS: HDMI0.4 IC1.2(DOUT1+)
TCK_1: IC3.1(DIN1) IC21.14(Y1) R7.1 R8.2
TCK_2: IC5.1(DIN1) IC21.15(Y2) R32.1 R33.2
TCK_3: IC7.1(DIN1) IC21.12(Y3) R38.1 R39.2
TCK_4: IC9.1(DIN1) IC21.1(Y4) R44.1 R45.2
TCK_5: IC21.5(Y5) JP3.6
TCK_5_2: IC11.1(DIN1) JP4.6 R50.1 R51.2
TCK_6: IC21.2(Y6) JP3.5
TCK_6_2: IC13.1(DIN1) JP4.5 R56.1 R57.2
TCK_7: IC21.4(Y7) JP3.4
TCK_7_2: IC15.1(DIN1) JP4.4 R62.1 R63.2
TCK_8: IC22.13(Y0) JP3.3
TCK_8_2: IC17.1(DIN1) JP4.3 R68.1 R69.2
TCK_9: IC22.14(Y1) JP3.2
TCK_9_2: IC19.1(DIN1) JP4.2 R74.1 R75.2
TDI: IC23.3(Z) IC24.3(Z) MOD1.3(TDI) R27.2
TDI_0: IC1.9(DIN3) IC23.13(Y0) R5.1 R6.2
TDI_0_N: HDMI0.12 IC1.11(DOUT3-)
TDI_0_P: HDMI0.10 IC1.10(DOUT3+)
TDI_1: IC3.9(DIN3) IC23.14(Y1) R30.1 R31.2
TDI_2: IC5.9(DIN3) IC23.15(Y2) R36.1 R37.2
TDI_3: IC7.9(DIN3) IC23.12(Y3) R42.1 R43.2
TDI_4: IC9.9(DIN3) IC23.1(Y4) R48.1 R49.2
TDI_5: IC23.5(Y5) JP5.6
TDI_5_2: IC11.9(DIN3) JP6.6 R54.1 R55.2
TDI_6: IC23.2(Y6) JP5.5
TDI_6_2: IC13.9(DIN3) JP6.5 R60.1 R61.2
TDI_7: IC23.4(Y7) JP5.4
TDI_7_2: IC15.9(DIN3) JP6.4 R66.1 R67.2
TDI_8: IC24.13(Y0) JP5.3
TDI_8_2: IC17.9(DIN3) JP6.3 R72.1 R73.2
TDI_9: IC24.14(Y1) JP5.2
TDI_9_2: IC19.9(DIN3) JP6.2 R78.1 R79.2
TDO: IC27.3(Z) IC28.3(Z) MOD1.8(TDO) R29.2
TDO_0: IC2.5(R) IC27.13(Y0)
TDO_0_N: HDMI0.3 IC2.4(B)
TDO_0_P: HDMI0.1 IC2.3(A)
TDO_1: IC4.5(R) IC27.14(Y1)
TDO_1_N: HDMI1.3 IC4.4(B)
TDO_1_P: HDMI1.1 IC4.3(A)
TDO_2: IC6.5(R) IC27.15(Y2)
TDO_2_N: HDMI2.3 IC6.4(B)
TDO_2_P: HDMI2.1 IC6.3(A)
TDO_3: IC8.5(R) IC27.12(Y3)
TDO_3_N: HDMI3.3 IC8.4(B)
TDO_3_P: HDMI3.1 IC8.3(A)
TDO_4: IC10.5(R) IC27.1(Y4)
TDO_4_N: HDMI4.3 IC10.4(B)
TDO_4_P: HDMI4.1 IC10.3(A)
TDO_5: IC27.5(Y5) JP9.6
TDO_5_2: IC12.5(R) JP10.6
TDO_5_N: HDMI5.3 IC12.4(B)
TDO_5_P: HDMI5.1 IC12.3(A)
TDO_6: IC27.2(Y6) JP9.5
TDO_6_2: IC14.5(R) JP10.5
TDO_6_N: HDMI6.3 IC14.4(B)
TDO_6_P: HDMI6.1 IC14.3(A)
TDO_7: IC27.4(Y7) JP9.4
TDO_7_2: IC16.5(R) JP10.4
TDO_7_N: HDMI7.3 IC16.4(B)
TDO_7_P: HDMI7.1 IC16.3(A)
TDO_8: IC28.13(Y0) JP9.3
TDO_8_2: IC18.5(R) JP10.3
TDO_8_N: HDMI8.3 IC18.4(B)
TDO_8_P: HDMI8.1 IC18.3(A)
TDO_9: IC28.14(Y1) JP9.2
TDO_9_2: IC20.5(R) JP10.2
TDO_9_N: HDMI9.3 IC20.4(B)
TDO_9_P: HDMI9.1 IC20.3(A)
TMS: IC25.3(Z) IC26.3(Z) MOD1.4(TMS) R28.2
TMS_0: IC1.7(DIN2) IC25.13(Y0) R3.1 R4.2
TMS_0_N: HDMI0.9 IC1.5(DOUT2-)
TMS_0_P: HDMI0.7 IC1.6(DOUT2+)
TMS_1: IC3.7(DIN2) IC25.14(Y1) R9.1 R10.2
TMS_2: IC5.7(DIN2) IC25.15(Y2) R34.1 R35.2
TMS_3: IC7.7(DIN2) IC25.12(Y3) R40.1 R41.2
TMS_4: IC9.7(DIN2) IC25.1(Y4) R46.1 R47.2
TMS_5: IC25.5(Y5) JP7.6
TMS_5_2: IC11.7(DIN2) JP8.6 R52.1 R53.2
TMS_6: IC25.2(Y6) JP7.5
TMS_6_2: IC13.7(DIN2) JP8.5 R58.1 R59.2
TMS_7: IC25.4(Y7) JP7.4
TMS_7_2: IC15.7(DIN2) JP8.4 R64.1 R65.2
TMS_8: IC26.13(Y0) JP7.3
TMS_8_2: IC17.7(DIN2) JP8.3 R70.1 R71.2
TMS_9: IC26.14(Y1) JP7.2
TMS_9_2: IC19.7(DIN2) JP8.2 R76.1 R77.2
Unconnected: IC22.1(Y4) IC22.2(Y6) IC22.4(Y7) IC22.5(Y5) IC22.12(Y3) IC22.15(Y2) IC24.1(Y4) IC24.2(Y6) IC24.4(Y7) IC24.5(Y5) IC24.12(Y3) IC24.15(Y2) IC26.1(Y4) IC26.2(Y6) IC26.4(Y7) IC26.5(Y5) IC26.12(Y3) IC26.15(Y2) IC28.1(Y4) IC28.2(Y6) IC28.4(Y7) IC28.5(Y5) IC28.12(Y3) IC28.15(Y2) IC30.1(NC) MOD1.5(GPIO_0) MOD1.6(GPIO_1) MOD1.7(GPIO_2)

## Notes on the sheet
- ADDRESS INPUT FROM CONTROLLER
- Change Log from V1
- Replaced DS90C031 (5V) with DS90LV031ATMX (3v3)
- Removed redundant 100R terminators on SN65LVDT2 ICs
- Added SJ 11, 12 & 13 to deactivate diagnostic LEDs
- Added weak pull-downs on multiplexer outputs and positions for weak pull-ups instead.
- Added 5v supply to address input to provide external power
- Changed electrolytic caps to tantalum for more stable ESR with temperature to ensure 3.3v regulator stability
- Removed spare mounting hole
- Rerouted GND traces between pins of HDMI connectors
- Change Log from V3
- V3 used 'Cream' layer to generate solder mask which left NO solder jumpers covered. V4 uses 'Stop' layer instead.

## Library data of the parts
C1 C4 C36 = SparkFun-Passives:CAP_POL: Capacitor Polarized These are standard SMD and PTH capacitors. Normally 10uF, 47uF, and 100uF in electrolytic and tantalum varieties. Always verify the external diameter of the through hole cap, it varies with capacity, voltage, and manufacturer. The EIA devices should be standard.
C2 C3 C5-C35 C37 = SparkFun-Passives:CAP: Capacitor Standard 0603 ceramic capacitor, and 0.1" leaded capacitor.
CON1 = Connectors:SL5.08/2
D1-D9 = SparkFun-LED:LED-RED: Assorted Red LEDs LilyPad 1206- DIO-09912 1206- DIO-00809 0603- DIO-00819; PROD_ID: DIO-00819
HDMI0 HDMI1-HDMI9 = Connectors:47266-0001
IC1 IC3 IC5 IC7 IC9 IC11 IC13 IC15 IC17 IC19 = ICs:DS90C031TM: Line Driver; MPN: DS90C031TM; OC_FARNELL: 9490108; OC_NEWARK: 92F258; PACKAGE: SOIC-16; SUPPLIER: NationalSemiconductor
IC2 IC4 IC6 IC8 IC10 IC12 IC14 IC16 IC18 IC20 = ICs:SN65LVDT2DBVT: HIGH-SPEED DIFFERENTIAL LINE DRIVER/RECEIVERS; MPN: SN65LVDT2DBVT; OC_FARNELL: 1575586; OC_NEWARK: 76C0822; PACKAGE: SOT-23-5; SUPPLIER: Texas Instruments
IC21-IC28 = ICs:74LV4051PW
IC29 = SparkFun-PowerIC:V_REG_78XX: Voltage Regulator Standard 7805 5V regulator. IGO (Input Ground Output). Spark Fun Electronics SKU : COM-00107
IC30 = ICs:74LVC1G14SE-7: SINGLE SCHMITT-TRIGGER INVERETER; MPN: 74LVC1G14SE-7; OC_FARNELL: 1893832; OC_NEWARK: 47T3919; PACKAGE: SOT-5; SUPPLIER: DIODES INC.
JP1-JP11 = SparkFun-Connectors:M06: Header 6 Standard 6-pin 0.1" header. Use with straight break away headers (SKU : PRT-00116), right angle break away headers (PRT-00553), swiss pins (PRT-00743), machine pins (PRT-00117), and female headers (PRT-00115). Molex polarized connector foot print use with SKU : PRT-08094 with associated crimp pins and housings. NOTES ON THE VARIANTS LOCK and LOCK_LONGPADS... This footprint was designed to help hold the alignment of a through-hole component (i.e. 6-pin header) while soldering it into place. You may notice that each hole has been shifted either up or down by 0.005 of an inch from it's more standard position (which is a perfectly straight line). This slight alteration caused the pins (the squares in the middle) to touch the edges of the holes. Because they are alternating, it causes a "brace" to hold the component in place. 0.005 has proven to be the perfect amount of "off-center" position when using our standard breakaway headers. Although looks a little odd when you look at the bare footprint, once you have a header in there, the alteration is very hard to notice. Also,if you push a header all the way into place, it is covered up entirely on the bottom side. This idea of altering the position of holes to aid alignment will be further integrated into the Sparkfun Library for other footprints. It can help hold any component with 3 or more connection pins.
JP12 JP13 = SparkFun-Connectors:M02: Standard 2-pin 0.1" header. Use with - straight break away headers ( PRT-00116) - right angle break away headers (PRT-00553) - swiss pins (PRT-00743) - machine pins (PRT-00117) - female headers (PRT-00115) Molex polarized connector foot print use with: PRT-08233 with associated crimp pins and housings. 2.54_SCREWTERM for use with PRT-10571. 3.5mm Screw Terminal footprints for PRT-08084 5mm Screw Terminal footprints for use with PRT-08433
MOD1 = modules:JTAG-SMT2
R1-R79 = SparkFun-Passives:RESISTOR: Resistor Basic schematic elements and footprints for 0603, 1206, and PTH resistors.
SJ1-SJ13 = SparkFun-Passives:SOLDERJUMPER: Solder Jumper Standard SMD solder jumper. Used to automate production. Two varients : Normally Open and Normally Closed are the same, but have different paste layers. NC will have a large amount of paste and should jumper during reflow.
STANDOFF1-STANDOFF7 = SparkFun-Electromechanical:STAND-OFF: #4 Stand Off This is the mechanical footprint for a #4 phillips button head screw. Use the keepout ring to avoid running the screw head into surrounding components. SKU : PRT-00447
TP1 TP2 = SparkFun-Passives:TEST-POINT: Bare copper test points for troubleshooting or ICT